# EAGLE design schematic_v2 (EAGLE 9.5.2)
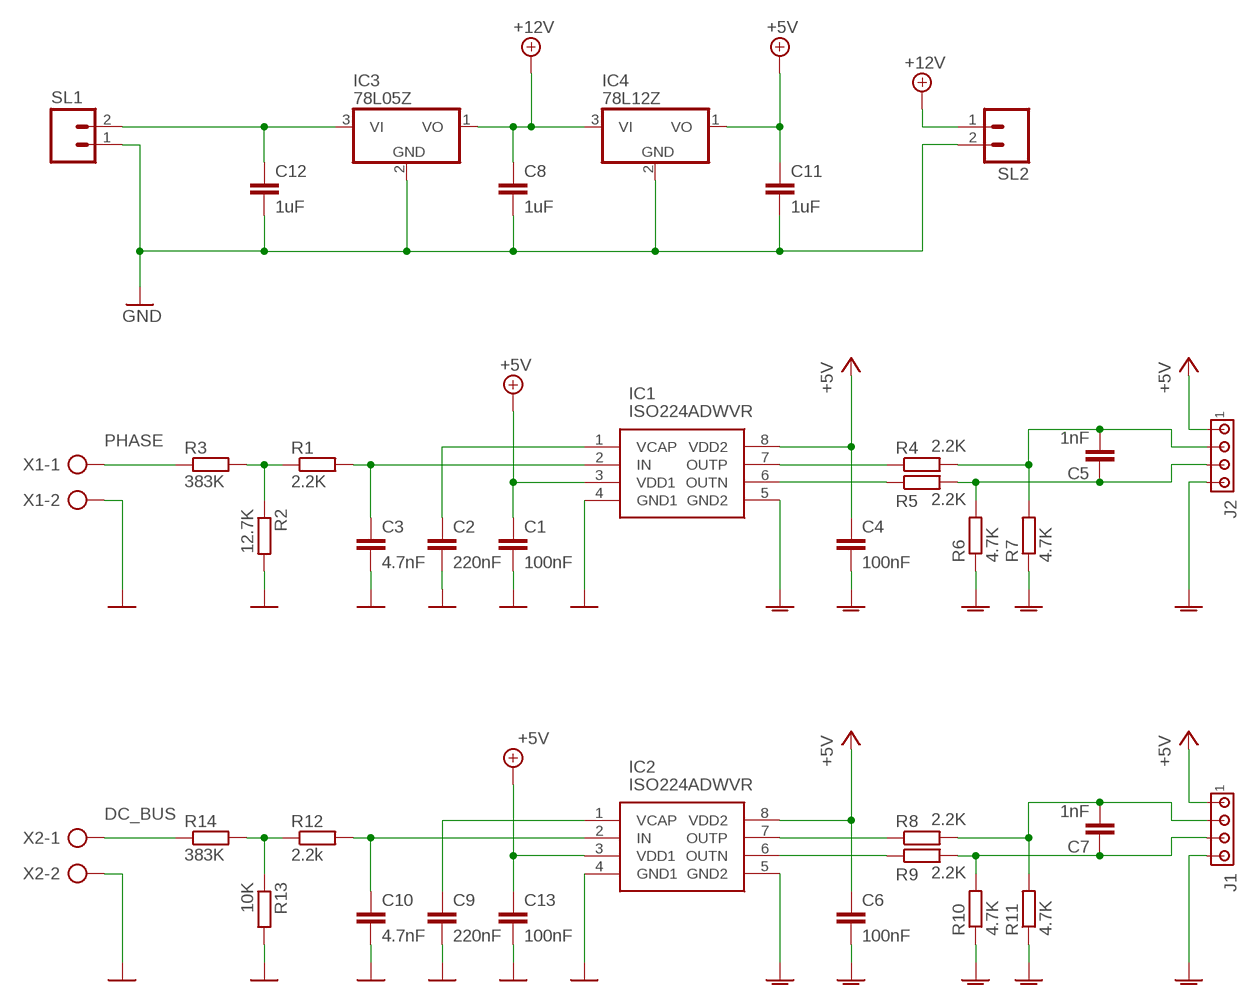
[diagram p0: schematic, sheet 1]

## Parts
C1  100nF  C-EUC0805  [C0805]
C2  220nF  C-EUC0805  [C0805]
C3  4.7nF  C-EUC0805  [C0805]
C4  100nF  C-EUC0805  [C0805]
C5  1nF  C-EUC0805  [C0805]
C6  100nF  C-EUC0805  [C0805]
C7  1nF  C-EUC0805  [C0805]
C8  1uF  C-EUC0805  [C0805]
C9  220nF  C-EUC0805  [C0805]
C10  4.7nF  C-EUC0805  [C0805]
C11  1uF  C-EUC0805  [C0805]
C12  1uF  C-EUC0805  [C0805]
C13  100nF  C-EUC0805  [C0805]
IC1  ISO224ADWVR  [SOIC127P1150X280-8N]
IC2  ISO224ADWVR  [SOIC127P1150X280-8N]
IC3  78L05Z  [TO92]
IC4  78L12Z  [TO92]
J1  MTA04-100  [10X04MTA]
J2  MTA04-100  [10X04MTA]
R1  2.2K  R-EU_R0805  [R0805]
R2  12.7K  R-EU_0207/10  [0207/10]
R3  383K  R-EU_0207/10  [0207/10]
R4  2.2K  R-EU_R0805  [R0805]
R5  2.2K  R-EU_R0805  [R0805]
R6  4.7K  R-EU_R0805  [R0805]
R7  4.7K  R-EU_R0805  [R0805]
R8  2.2K  R-EU_R0805  [R0805]
R9  2.2K  R-EU_R0805  [R0805]
R10  4.7K  R-EU_R0805  [R0805]
R11  4.7K  R-EU_R0805  [R0805]
R12  2.2k  R-EU_R0805  [R0805]
R13  10K  R-EU_0207/10  [0207/10]
R14  383K  R-EU_0207/10  [0207/10]
SL1  M02  [02P]
SL2  M02  [02P]
X1  AK500/2  [AK500/2]
X2  AK500/2  [AK500/2]

## Nets
+5V: C1.1 C4.1 C6.1 C11.1 C13.1 IC1.3(VDD1) IC1.8(VDD2) IC2.3(VDD1) IC2.8(VDD2) IC4.1(VO) J1.1 J2.1
+12V: C8.1 IC3.1(VO) IC4.3(VI) SL2.1
DC_BUS: R14.1 X2.1
GND: C1.2 C2.2 C3.2 C8.2 C9.2 C10.2 C11.2 C12.2 C13.2 IC1.4(GND1) IC2.4(GND1) IC3.2(GND) IC4.2(GND) R2.2 R13.2 SL1.1 SL2.2 X1.2 X2.2
GNDA: C4.2 C6.2 IC1.5(GND2) IC2.5(GND2) J1.4 J2.4 R6.1 R7.1 R10.1 R11.1
N$1: C12.1 IC3.3(VI) SL1.2
N$2: C2.1 IC1.1(VCAP)
N$3: C3.1 IC1.2(IN) R1.2
N$4: R1.1 R2.1 R3.2
N$5: IC2.7(OUTP) R8.1
N$6: IC1.7(OUTP) R4.1
N$7: IC1.6(OUTN) R5.1
N$8: C5.1 J2.3 R5.2 R6.2
N$9: C5.2 J2.2 R4.2 R7.2
N$10: IC2.6(OUTN) R9.1
N$11: C7.1 J1.3 R9.2 R10.2
N$12: C7.2 J1.2 R8.2 R11.2
N$13: C10.1 IC2.2(IN) R12.2
N$14: R12.1 R13.1 R14.2
N$15: C9.1 IC2.1(VCAP)
PHASE: R3.1 X1.1

## Library data of the parts
C1-C13 = rcl:C-EU: CAPACITOR, European symbol; SPICEPREFIX: C
IC1 IC2 = ISO224ADWVR:ISO224ADWVR: Reinforced isolated amplifier for voltage sensing with +/-12-V input Source: Datasheet <http://www.ti.com/lit/gpn/ISO224>; DESCRIPTION: Reinforced isolated amplifier for voltage sensing with +/-12-V input; HEIGHT: 2.8mm; MANUFACTURER_NAME: Texas Instruments; MANUFACTURER_PART_NUMBER: ISO224ADWVR; MOUSER_PART_NUMBER: 595-ISO224ADWVR; MOUSER_PRICE-STOCK: https://www.mouser.co.uk/ProductDetail/Texas-Instruments/ISO224ADWVR?qs=%252BEew9%252B0nqrBSdeiKbZwKlA%3D%3D
IC3 IC4 = linear:78*: Positive VOLTAGE REGULATOR Source: http://cache.national.com/ds/LM/LM78L05.pdf http://www.fairchildsemi.com/ds/LM/LM7805.pdf
J1 J2 = con-amp:MTA04-100: AMP connector
R1-R14 = rcl:R-EU_: RESISTOR, European symbol; SPICEPREFIX: R
SL1 SL2 = con-amp-quick:M02: AMP QUICK CONNECTOR; OC_FARNELL: unknown; OC_NEWARK: unknown
X1 X2 = con-ptr500:AK500/2: CONNECTOR; OC_FARNELL: unknown; OC_NEWARK: unknown

## Board
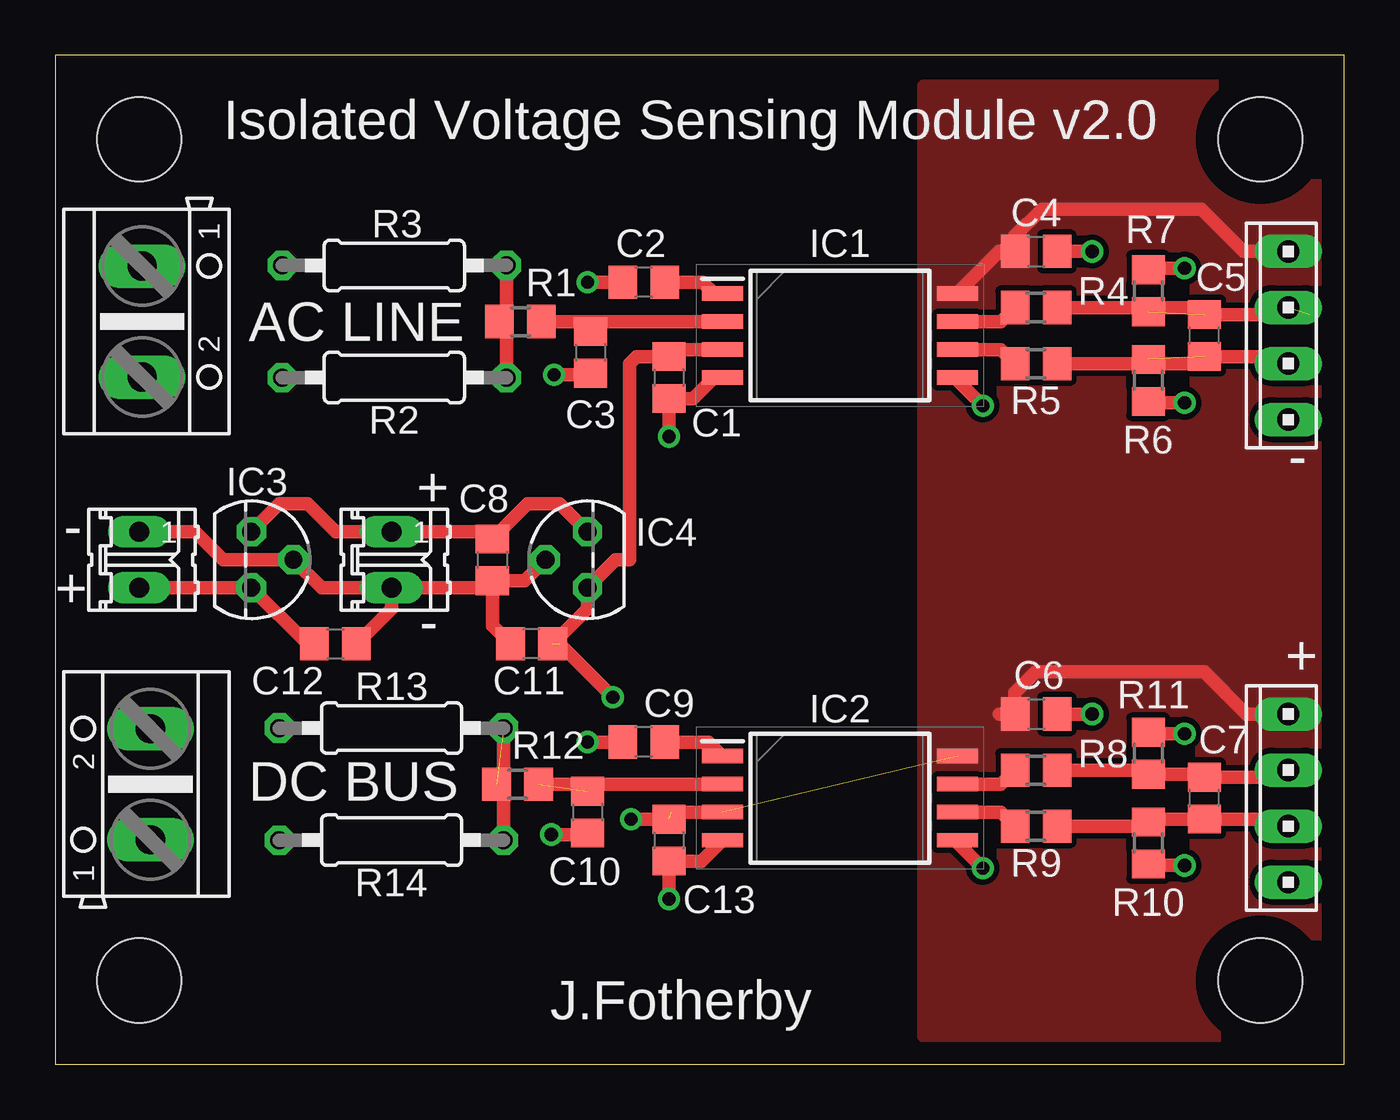
[diagram p1: board, top side]
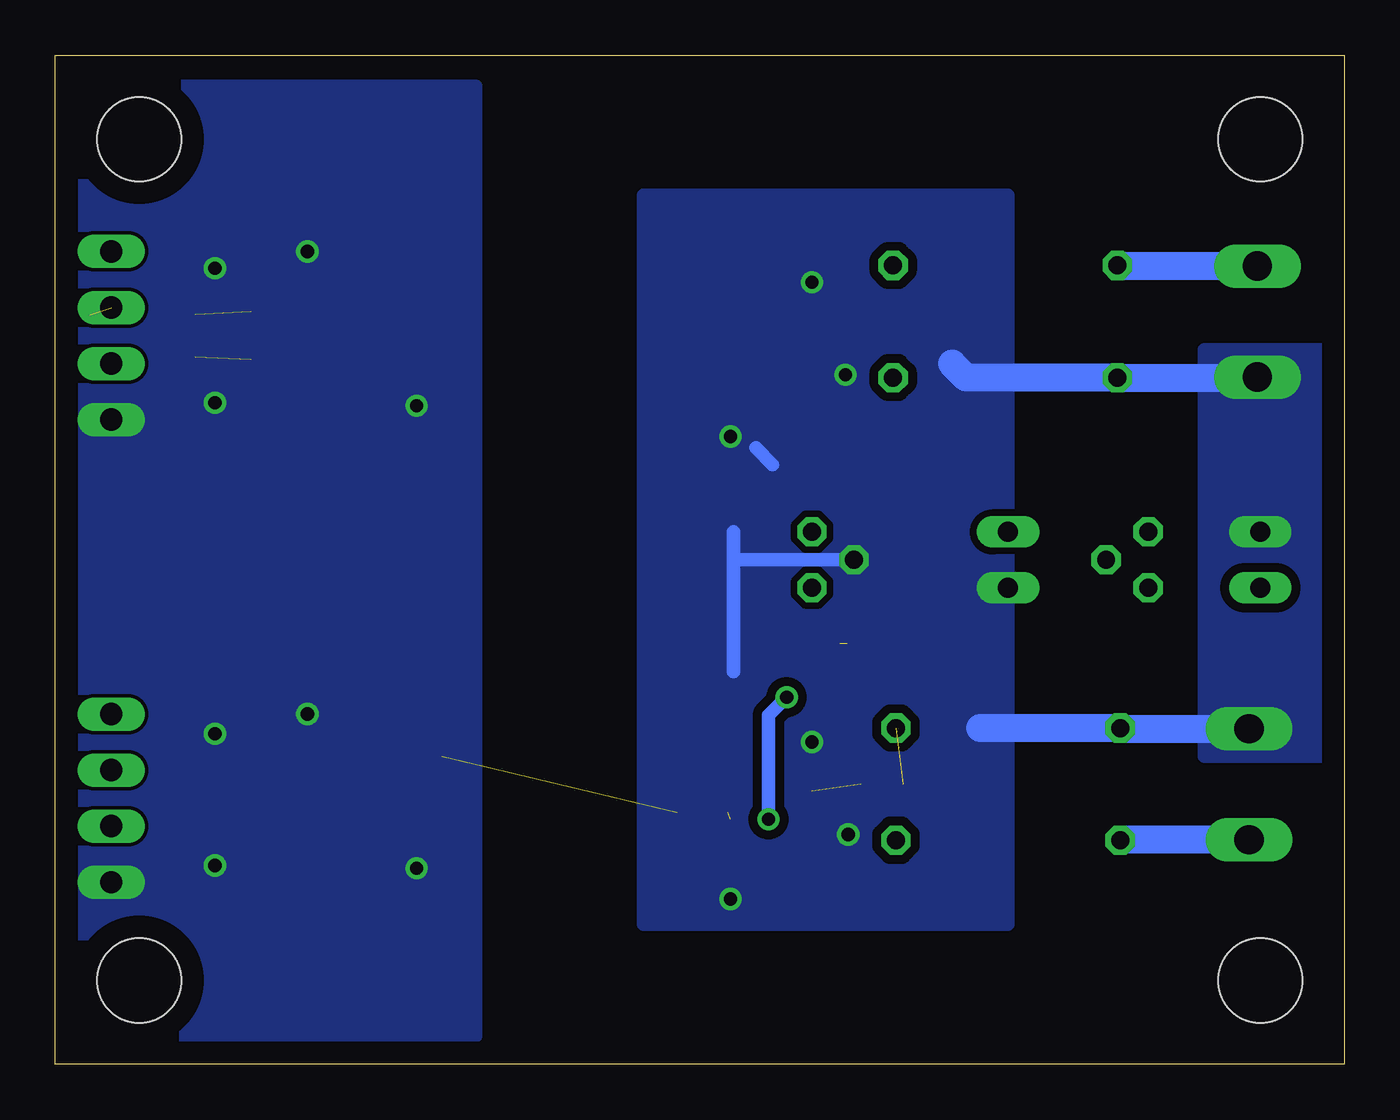
[diagram p2: board, bottom side, seen from below]

Size 58.42 x 45.72 mm. Coordinates in mm from the lower left corner, seen from the top.
Outline: 0,0 58.42,0 58.42,45.72 0,45.72 0,0
Copper layers (1*16): Top 0.035mm / dielectric 1.5mm / Bottom 0.035mm
Design rules "default": minimum track width 6mil, minimum drill 0.35mm, track to track 6mil, track to pad 6mil, pad to pad 6mil, via to via 6mil, smd to smd 6mil, copper to edge 40mil, drill to drill 6mil, minimum pad ring 10mil, minimum via ring 8mil, stop-mask expansion 4mil, vias tented up to drill 0mil, thermal gap 10mil
Holes 3.81 mm at 3.81,3.81 54.61,3.81 54.61,41.91 3.81,41.91

### Footprints (pad centres in the part's own frame; a part is rotated, then mirrored left to right if it is on the bottom)
C0805 = smd 1.3 x 1.5: 1 -0.95,0; 2 0.95,0
SOIC127P1150X280-8N = smd 1.85 x 0.65: 1 -5.325,1.905; 2 -5.325,0.635; 3 -5.325,-0.635; 4 -5.325,-1.905; 5 5.325,-1.905; 6 5.325,-0.635; 7 5.325,0.635; 8 5.325,1.905
TO92 = drill 0.813 octagon: 1 -1.27,0; 2 0,1.905; 3 1.27,0
10X04MTA = drill 1.016 long: 1 3.81,0; 2 1.27,0; 3 -1.27,0; 4 -3.81,0
R0805 = smd 1.3 x 1.5: 1 -0.95,0; 2 0.95,0
0207/10 = drill 0.813 octagon: 1 -5.08,0; 2 5.08,0
02P = drill 0.914 long: 1 -1.27,0; 2 1.27,0
AK500/2 = drill 1.321 long: 1 -2.515,0; 2 2.515,0

### Placement (x,y rotation side)
C1  27.81,31.11 270 top
C2  26.67,35.43 180 top
C3  24.26,32.26 270 top
C4  44.45,36.83 0 top
C5  52.07,33.02 90 top
C6  44.45,15.88 0 top
C7  52.07,12.06 90 top
C8  19.81,22.86 270 top
C9  26.67,14.61 180 top
C10  24.13,11.43 270 top
C11  21.59,19.05 180 top
C12  12.7,19.05 0 top
C13  27.81,10.16 270 top
IC1  35.56,33.02 0 top
IC2  35.56,12.06 0 top
IC3  8.89,22.86 270 top
IC4  24.13,22.86 90 top
J1  55.88,12.06 90 top
J2  55.88,33.02 90 top
R1  21.08,33.66 0 top
R2  15.37,31.11 180 top
R3  15.37,36.2 0 top
R4  44.45,34.29 0 top
R5  44.45,31.75 0 top
R6  49.53,30.99 90 top
R7  49.53,35.05 270 top
R8  44.45,13.34 0 top
R9  44.45,10.79 0 top
R10  49.53,10.03 90 top
R11  49.53,14.1 270 top
R12  20.95,12.7 0 top
R13  15.24,15.24 180 top
R14  15.24,10.16 0 top
SL1  3.81,22.86 270 top
SL2  15.24,22.86 270 top
X1  3.94,33.66 270 top
X2  4.32,12.7 90 top

### Tracks (layer width: path | path; a pad name or v marks a point on that pad's centre or on a via)
+5V  (via drill 0.6)  (3 unrouted)
  Top 0.61: IC1.8 42.79,36.83 C4.1 43.5,37.53 44.7,38.73 51.94,38.73 53.85,36.83 J2.1 | IC1.3 28.13,32.38 C1.1 26.35,32.06 26.04,31.75 26.04,22.86 25.4,22.86 IC4.1 24.13,20.64 C11.1 | J1.1 53.98,15.88 52.07,17.78 44.45,17.78 43.5,16.83 C6.1 42.79,15.88 | IC2.3 27.94,11.43 | C13.1 26.23,11.11 26.16,11.18 v26.1,11.11 | v25.27,16.64 22.86,19.05
  Bottom 0.61: v25.27,16.64 26.1,15.81 v26.1,11.11
  pour Top (isolate 0.254, no thermals): 39.37,44.32 57.15,44.32 57.15,1.27 39.37,1.27
+12V
  Top 0.61: IC3.1 10.16,25.4 11.43,25.4 12.7,24.13 SL2.1 19.49,24.13 C8.1 21.4,25.4 22.86,25.4 IC4.3
DC_BUS
  Bottom 1.27: X2.1 10.13,10.19 R14.1
GND  (via drill 0.6)
  Top 0.61: IC1.4 29.84,31.11 28.89,30.16 C1.2 v27.81,28.45 | C2.2 v24.13,35.43 | v22.61,31.24 24.19,31.24 C3.2 | v24.13,14.61 C9.2 | SL2.2 12.06,21.59 IC3.2 7.62,22.86 6.35,24.13 SL1.1 | SL2.2 19.49,21.59 C8.2 | IC4.2 21.27,21.91 C8.2 | C12.2 15.24,20.64 SL2.2 | C11.2 19.81,19.88 C8.2 | C10.2 24.06,10.41 v22.48,10.41 | IC2.4 29.29,9.21 C13.2 v27.81,7.49
  Bottom 0.61: IC4.2 27.69,22.86 | 27.69,22.86 27.69,17.78 | 27.69,22.86 27.69,24.13 | 25.91,27.18 26.67,27.94
  Bottom 1.27: 17.78,31.75 17.14,31.11 R2.2 3.96,31.11 X1.2 | 16.51,15.24 R13.2 10.13,15.21 X2.2
  pour Bottom (isolate 0.406, no thermals): 15.24,39.37 31.75,39.37 31.75,26.67 15.24,26.67
  pour Bottom (isolate 0.406, no thermals): 15.24,19.05 31.75,19.05 31.75,6.35 15.24,6.35
  pour Bottom (isolate 0.305, no thermals): 31.75,26.67 31.75,19.05 15.24,19.05 15.24,26.67
  pour Bottom (isolate 0.406, no thermals): 0,32.38 6.35,32.38 6.35,13.97 0,13.97
GNDA  (via drill 0.6)
  Top 0.61: C4.2 v46.99,36.83 | v51.18,36.07 49.6,36.07 R7.1 | v51.18,29.97 49.6,29.97 R6.1 | v42.04,29.84 40.88,31 IC1.5 | v46.99,15.88 C6.2 | v51.18,14.99 49.59,14.99 R11.1 | v51.18,9.02 49.6,9.02 R10.1 | v42.04,8.89 40.88,10.04 IC2.5
  pour Bottom (no thermals): 39.37,44.32 39.37,1.27 57.15,1.27 57.15,44.32
N$1
  Top 0.61: SL1.2 IC3.3 11.43,19.05 C12.1
N$2
  Top 0.61: IC1.1 29.84,34.92 29.34,35.43 C2.1
N$3
  Top 0.61: IC1.2 24.26,33.66 | 24.26,33.66 R1.2 | C3.1 24.26,33.66
N$4
  Top 0.61: R3.2 20.45,33.34 | 20.45,33.34 R1.1 | R2.1 20.45,33.34
N$5
  Top 0.61: R8.1 42.87,12.7 IC2.7
N$6
  Top 0.61: IC1.7 42.87,33.66 R4.1
N$7
  Top 0.61: IC1.6 42.87,32.38 R5.1
N$8  (1 unrouted)
  Top 0.61: R5.2 51.75,31.75 C5.1 55.88,32.07 | 55.88,32.07 56.83,32.07 | J2.3 55.88,32.07
N$9  (2 unrouted)
  Top 0.61: R4.2 51.75,34.29 C5.2 56.83,33.97
N$10
  Top 0.61: R9.1 42.87,11.43 IC2.6
N$11
  Top 0.61: R9.2 49.34,10.79 R10.2 49.66,11.12 C7.1 55.56,11.12 J1.3
N$12
  Top 0.61: R8.2 49.34,13.34 R11.2 51.94,13.15 C7.2 55.56,13.02 J1.2
N$13  (1 unrouted)
  Top 0.61: R12.2 IC2.2
N$14  (1 unrouted)
  Top 0.61: R13.1 R14.2
N$15
  Top 0.61: C9.1 29.6,14.61 IC2.1
PHASE
  Bottom 1.27: X1.1 10.26,36.17 R3.1

### Text on the board
tNames: Isolated Voltage Sensing Module v2.0 | AC LINE | - | + | - | + | - | + | DC BUS | J.Fotherby